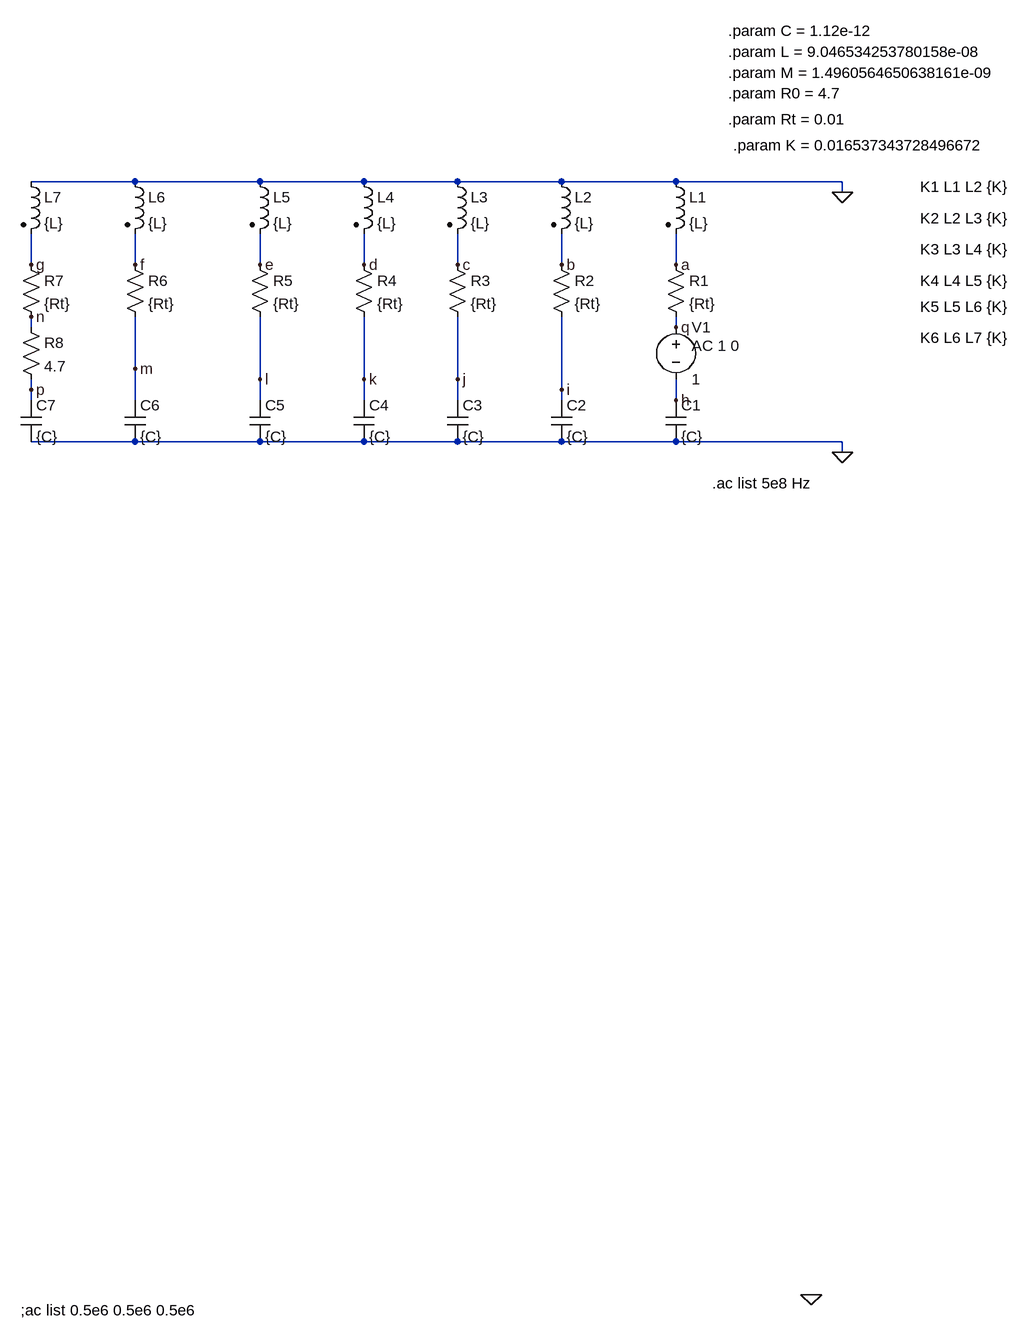
[diagram p0: schematic Draft2.asc]
Draft2.asc, the LTspice schematic file:
Version 4
SHEET 1 880 680
WIRE -640 -1504 -800 -1504
WIRE -448 -1504 -640 -1504
WIRE -288 -1504 -448 -1504
WIRE -144 -1504 -288 -1504
WIRE 16 -1504 -144 -1504
WIRE 192 -1504 16 -1504
WIRE 448 -1504 192 -1504
WIRE 448 -1488 448 -1504
WIRE -800 -1376 -800 -1424
WIRE -640 -1376 -640 -1424
WIRE -448 -1376 -448 -1424
WIRE -288 -1376 -288 -1424
WIRE -144 -1376 -144 -1424
WIRE 16 -1376 16 -1424
WIRE 192 -1376 192 -1424
WIRE -800 -1280 -800 -1296
WIRE 192 -1280 192 -1296
WIRE -640 -1216 -640 -1296
WIRE -448 -1200 -448 -1296
WIRE -288 -1200 -288 -1296
WIRE -144 -1200 -144 -1296
WIRE -800 -1184 -800 -1200
WIRE 16 -1184 16 -1296
WIRE -800 -1168 -800 -1184
WIRE -640 -1168 -640 -1216
WIRE -448 -1168 -448 -1200
WIRE -288 -1168 -288 -1200
WIRE -144 -1168 -144 -1200
WIRE 16 -1168 16 -1184
WIRE 192 -1168 192 -1200
WIRE -640 -1104 -800 -1104
WIRE -448 -1104 -640 -1104
WIRE -288 -1104 -448 -1104
WIRE -144 -1104 -288 -1104
WIRE 16 -1104 -144 -1104
WIRE 192 -1104 16 -1104
WIRE 448 -1104 192 -1104
WIRE 448 -1088 448 -1104
FLAG 400 208 0
FLAG 448 -1088 0
FLAG 448 -1488 0
FLAG 192 -1376 a
FLAG 16 -1376 b
FLAG -144 -1376 c
FLAG -288 -1376 d
FLAG -448 -1376 e
FLAG -640 -1376 f
FLAG -800 -1376 g
FLAG 192 -1168 h
FLAG 16 -1184 i
FLAG -144 -1200 j
FLAG -288 -1200 k
FLAG -448 -1200 l
FLAG -640 -1216 m
FLAG -800 -1296 n
FLAG -800 -1184 p
FLAG 192 -1280 q
SYMBOL cap 176 -1168 R0
SYMATTR InstName C1
SYMATTR Value {C}
SYMBOL res 176 -1392 R0
SYMATTR InstName R1
SYMATTR Value {Rt}
SYMBOL ind2 176 -1520 R0
SYMATTR InstName L1
SYMATTR Value {L}
SYMATTR Type ind
SYMATTR SpiceLine Rser=0
SYMBOL cap 0 -1168 R0
SYMATTR InstName C2
SYMATTR Value {C}
SYMBOL res 0 -1392 R0
SYMATTR InstName R2
SYMATTR Value {Rt}
SYMBOL ind2 0 -1520 R0
SYMATTR InstName L2
SYMATTR Value {L}
SYMATTR Type ind
SYMATTR SpiceLine Rser=0
SYMBOL cap -160 -1168 R0
SYMATTR InstName C3
SYMATTR Value {C}
SYMBOL res -160 -1392 R0
SYMATTR InstName R3
SYMATTR Value {Rt}
SYMBOL ind2 -160 -1520 R0
SYMATTR InstName L3
SYMATTR Value {L}
SYMATTR Type ind
SYMATTR SpiceLine Rser=0
SYMBOL cap -304 -1168 R0
SYMATTR InstName C4
SYMATTR Value {C}
SYMBOL res -304 -1392 R0
SYMATTR InstName R4
SYMATTR Value {Rt}
SYMBOL ind2 -304 -1520 R0
SYMATTR InstName L4
SYMATTR Value {L}
SYMATTR Type ind
SYMATTR SpiceLine Rser=0
SYMBOL cap -464 -1168 R0
SYMATTR InstName C5
SYMATTR Value {C}
SYMBOL res -464 -1392 R0
SYMATTR InstName R5
SYMATTR Value {Rt}
SYMBOL ind2 -464 -1520 R0
SYMATTR InstName L5
SYMATTR Value {L}
SYMATTR Type ind
SYMATTR SpiceLine Rser=0
SYMBOL cap -656 -1168 R0
SYMATTR InstName C6
SYMATTR Value {C}
SYMBOL res -656 -1392 R0
SYMATTR InstName R6
SYMATTR Value {Rt}
SYMBOL ind2 -656 -1520 R0
SYMATTR InstName L6
SYMATTR Value {L}
SYMATTR Type ind
SYMATTR SpiceLine Rser=0
SYMBOL cap -816 -1168 R0
SYMATTR InstName C7
SYMATTR Value {C}
SYMBOL res -816 -1392 R0
SYMATTR InstName R7
SYMATTR Value {Rt}
SYMBOL ind2 -816 -1520 R0
SYMATTR InstName L7
SYMATTR Value {L}
SYMATTR Type ind
SYMATTR SpiceLine Rser=0
SYMBOL res -816 -1296 R0
SYMATTR InstName R8
SYMATTR Value 4.7
SYMBOL voltage 192 -1296 R0
WINDOW 123 24 44 Left 2
WINDOW 39 0 0 Left 0
SYMATTR InstName V1
SYMATTR Value 1
SYMATTR Value2 AC 1 0
TEXT 272 -1736 Left 2 !.param C = 1.12e-12
TEXT 272 -1704 Left 2 !.param L = 9.046534253780158e-08
TEXT 272 -1672 Left 2 !.param M = 1.4960564650638161e-09
TEXT 272 -1640 Left 2 !.param R0 = 4.7
TEXT 272 -1600 Left 2 !.param Rt = 0.01
TEXT 568 -1496 Left 2 !K1 L1 L2 {K}
TEXT 280 -1560 Left 2 !.param K = 0.016537343728496672
TEXT 568 -1448 Left 2 !K2 L2 L3 {K}
TEXT 568 -1400 Left 2 !K3 L3 L4 {K}
TEXT 568 -1352 Left 2 !K4 L4 L5 {K}
TEXT 568 -1312 Left 2 !K5 L5 L6 {K}
TEXT 568 -1264 Left 2 !K6 L6 L7 {K}
TEXT -816 232 Left 2 !;ac list 0.5e6 0.5e6 0.5e6
TEXT 248 -1040 Left 2 !.ac list 5e8 Hz

The netlist it stands for:
* Draft2.asc
C1 h 0 {C}
R1 a q {Rt}
L1 0 a {L} Rser=0
C2 i 0 {C}
R2 b i {Rt}
L2 0 b {L} Rser=0
C3 j 0 {C}
R3 c j {Rt}
L3 0 c {L} Rser=0
C4 k 0 {C}
R4 d k {Rt}
L4 0 d {L} Rser=0
C5 l 0 {C}
R5 e l {Rt}
L5 0 e {L} Rser=0
C6 m 0 {C}
R6 f m {Rt}
L6 0 f {L} Rser=0
C7 p 0 {C}
R7 g n {Rt}
L7 0 g {L} Rser=0
R8 n p 4.7
V1 q h 1 AC 1 0
.param C = 1.12e-12
.param L = 9.046534253780158e-08
.param M = 1.4960564650638161e-09
.param R0 = 4.7
.param Rt = 0.01
K1 L1 L2 {K}
.param K = 0.016537343728496672
K2 L2 L3 {K}
K3 L3 L4 {K}
K4 L4 L5 {K}
K5 L5 L6 {K}
K6 L6 L7 {K}
;ac list 0.5e6 0.5e6 0.5e6
.ac list 5e8 Hz
.backanno
.end

* Results of the author's LTspice run, read from the files saved beside the schematic
* AC Analysis:
*   frequency = 500 M
*   V(h) = -90.62 pV
*   V(a) = 997.9 mV
*   V(q) = 1 V
*   V(i) = 60.34 V
*   V(b) = 60.34 V
*   V(j) = 90.17 pV
*   V(c) = 2.119 mV
*   V(k) = -60.21 V
*   V(d) = -60.21 V
*   V(l) = -89.45 pV
*   V(e) = -2.114 mV
*   V(m) = 60.08 V
*   V(f) = 60.08 V
*   V(p) = 41.13 pV
*   V(g) = 993.6 mV
*   V(n) = 991.5 mV
*   I(C1) = -212.3 mA
*   I(C2) = 593.6 fA
*   I(C3) = 211.9 mA
*   I(C4) = -598.4 fA
*   I(C5) = -211.4 mA
*   I(C6) = 604.2 fA
*   I(C7) = 211 mA
*   I(L1) = -212.3 mA
*   I(L2) = 299.5 fA
*   I(L3) = 211.9 mA
*   I(L4) = -304.9 fA
*   I(L5) = -211.4 mA
*   I(L6) = 311.3 fA
*   I(L7) = 211 mA
*   I(R1) = -212.3 mA
*   I(R2) = 0 A
*   I(R3) = 211.9 mA
*   I(R4) = 0 A
*   I(R5) = -211.4 mA
*   I(R6) = 0 A
*   I(R7) = 211 mA
*   I(R8) = 211 mA
*   I(V1) = -212.3 mA